# Altium project GSMLiftSquare.PrjPcb
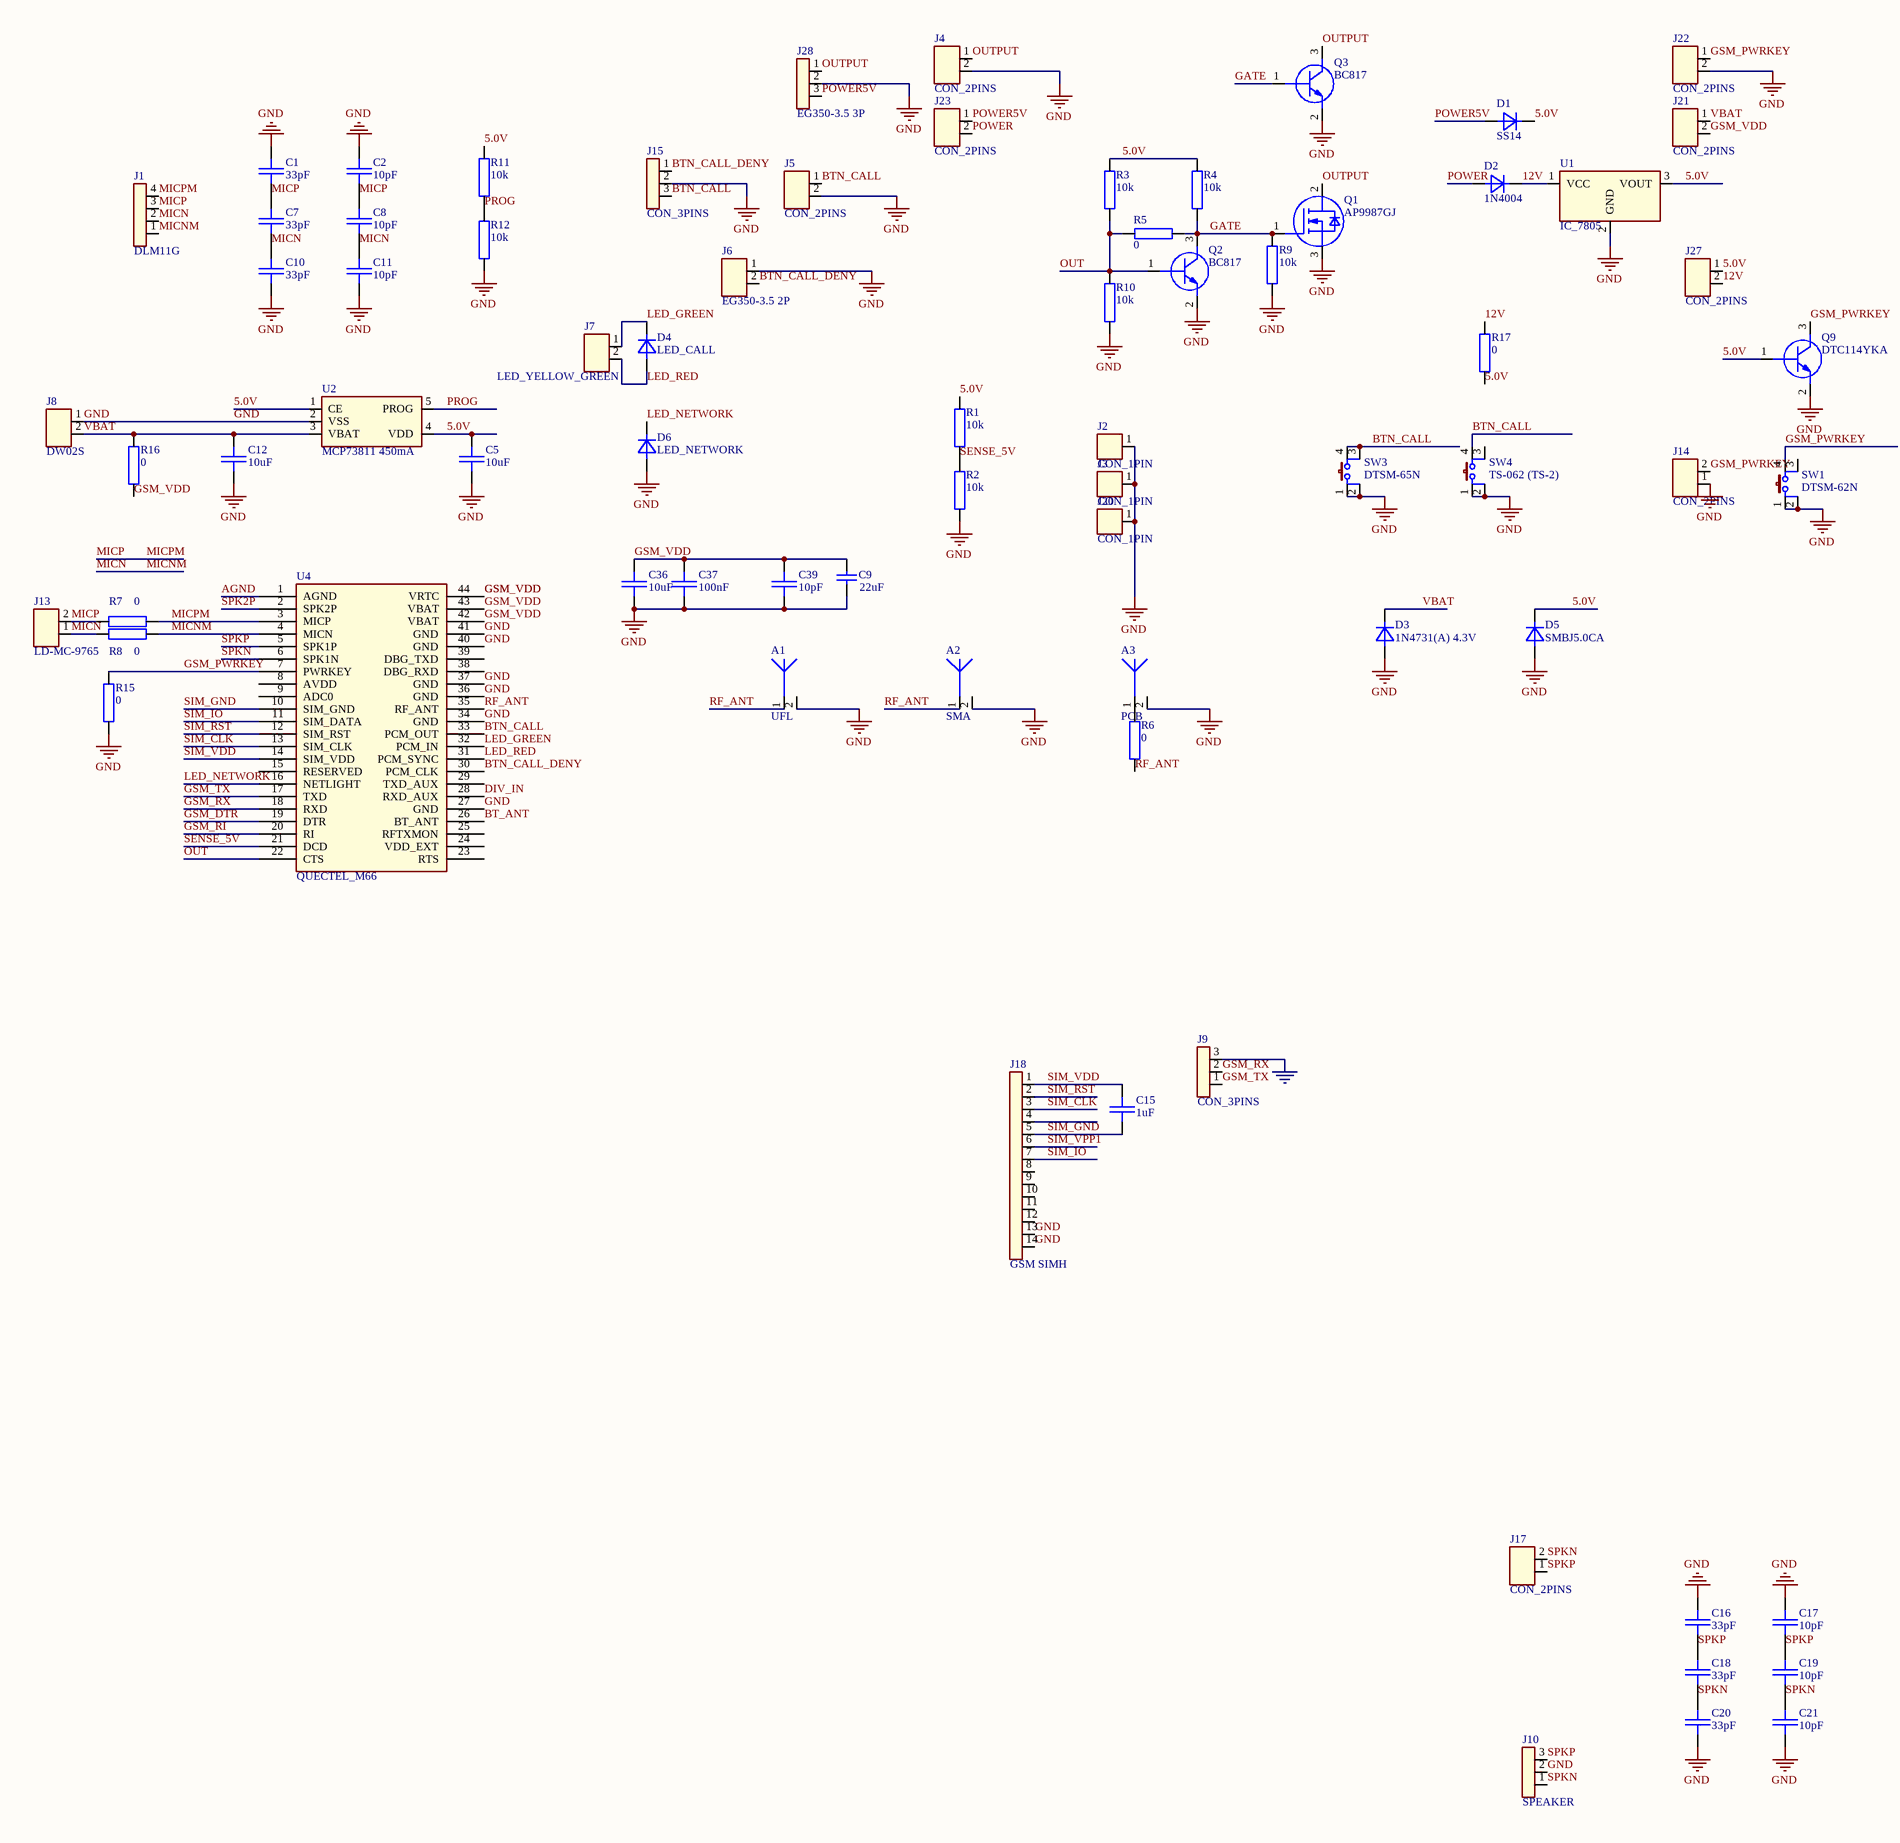
[diagram p0: GSMLiftSquare.SchDoc, left]
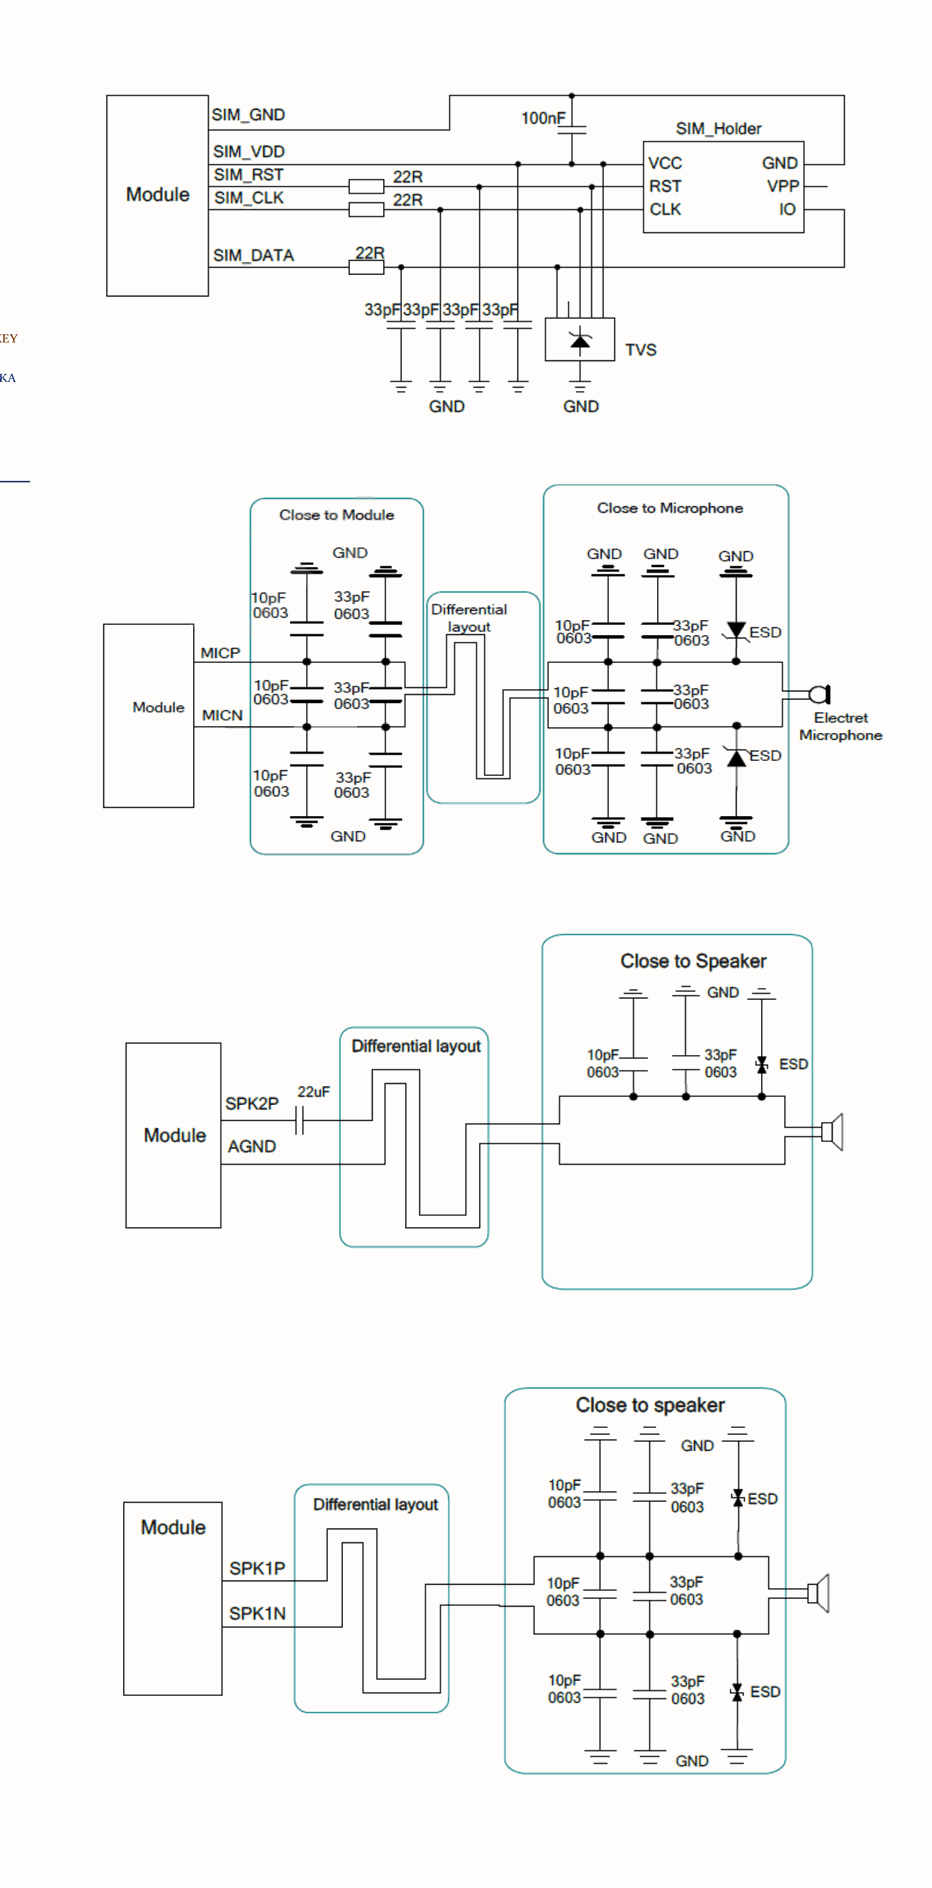
[diagram p1: GSMLiftSquare.SchDoc, right]
1 sheet, 74 parts. Net scope: global (net labels, ports and power ports of the same name join across sheets).
Board file: GSMLiftSquare.PcbDoc

## Sheet GSMLiftSquare.SchDoc
size A2

### Parts
A1  UFL  [SMD_CON_ANTENNA_UFL]
A2  SMA  [SMD_CON_ANTENNA_SMA_RIGHT_ANGLE]
A3  PCB  [SMD_CON_ANTENNA_GSM_PCB_1]
C1  33pF  [SMD_0603_CAPC1608X95N]
C2  10pF  [SMD_0603_CAPC1608X95N]
C5  10uF  [SMD_0603_CAPC1608X95N]
C7  33pF  [SMD_0603_CAPC1608X95N]
C8  10pF  [SMD_0603_CAPC1608X95N]
C9  22uF  [SMD_1210_CAPC3225X279N]
C10  33pF  [SMD_0603_CAPC1608X95N]
C11  10pF  [SMD_0603_CAPC1608X95N]
C12  10uF  [SMD_0603_CAPC1608X95N]
C15  1uF  [SMD_0603_CAPC1608X95N]
C16  33pF  [SMD_0603_CAPC1608X95N]
C17  10pF  [SMD_0603_CAPC1608X95N]
C18  33pF  [SMD_0603_CAPC1608X95N]
C19  10pF  [SMD_0603_CAPC1608X95N]
C20  33pF  [SMD_0603_CAPC1608X95N]
C21  10pF  [SMD_0603_CAPC1608X95N]
C36  10uF  [SMD_0805_CAPC2012X95N]
C37  100nF  [SMD_0603_CAPC1608X95N]
C39  10pF  [SMD_0603_CAPC1608X95N]
D1  SS14  [SMD_DO214AC_SMA]
D2  1N4004  [SMD_DO214AC_SMA]
D3  1N4731(A) 4.3V  [PTH_HDRV02W64P254_1X02]
D4  LED_CALL  [SMD_0805_LED2012X100N]
D5  SMBJ5.0CA  [SMD_DO214AC_SMB]
D6  LED_NETWORK  [SMD_0805_LED2012X100N]
J1  DLM11G  [SMD_COMMON_MODE_CHOKE]
J2  CON_1PIN  [PTH_MOUNT_HOLE]
J3  CON_1PIN  [PTH_MOUNT_HOLE]
J4  CON_2PINS  [PTH_HDRV02W11060P350_1X02]
J5  CON_2PINS  [PTH_HDRV02W11060P500_1X02]
J6  EG350-3.5 2P  [PTH_HDRV02W11060P350_1X02]
J7  LED_YELLOW_GREEN  [PTH_LED-KINGBRIGHT-L-934SGC]
J8  DW02S  [PTH_HDRV02W64P254_1X02_BATTERY]
J9  CON_3PINS  [PTH_HDRV03W64P254_1X03]
J10  SPEAKER  [PTH_SPEAKER_MCABS-227-RC]
J13  LD-MC-9765  [PTH_MIC_9.6MM_6MM]
J14  CON_2PINS  [PTH_HDRV02W64P254_1X02]
J15  CON_3PINS  [PTH_HDRV03W64P254_1X03]
J17  CON_2PINS  [PTH_HDRV02W64P254_1X02]
J18  GSM SIMH  [SMD_CON-ATTEND_SIM_115B-AAA0-R01]
J20  CON_1PIN  [PTH_MOUNT_HOLE]
J21  CON_2PINS  [PTH_HDRV02W64P254_1X02]
J22  CON_2PINS  [PTH_HDRV02W64P254_1X02]
J23  CON_2PINS  [PTH_HDRV02W11060P350_1X02]
J27  CON_2PINS  [PTH_HDRV02W64P254_1X02]
J28  EG350-3.5 3P  [PTH_HDRV02W11060P350_1X03]
Q1  AP9987GJ  [PTH_TO220AB]
Q2  BC817  [SMD_SOT23_SOT95P240X120-3N]
Q3  BC817  [SMD_SOT23_SOT95P240X120-3N]
Q9  DTC114YKA  [SMD_SOT23_SOT95P240X120-3N]
R1  10k  [SMD_0603_RESC1608X55N]
R2  10k  [SMD_0603_RESC1608X55N]
R3  10k  [SMD_0603_RESC1608X55N]
R4  10k  [SMD_0603_RESC1608X55N]
R5  0  [SMD_0603_RESC1608X55N]
R6  0  [SMD_0402_RESC1005X37N]
R7  0  [SMD_0402_RESC1005X37N]
R8  0  [SMD_0402_RESC1005X37N]
R9  10k  [SMD_0603_RESC1608X55N]
R10  10k  [SMD_0603_RESC1608X55N]
R11  10k  [SMD_0603_RESC1608X55N]
R12  10k  [SMD_0603_RESC1608X55N]
R15  0  [SMD_0603_RESC1608X55N]
R16  0  [SMD_0603_RESC1608X55N]
R17  0  [SMD_0603_RESC1608X55N]
SW1  DTSM-62N  [SMD_SW_TACT-64K_5]
SW3  DTSM-65N  [SMD_SW_TACT-64K_5]
SW4  TS-062 (TS-2)  [PTH_SWI_TACT-62K_5]
U1  IC_7805  [PTH_TO220AB]
U2  MCP73811 450mA  [SMD_SOT26_SOT95P285X140-5N - DLV]
U4  QUECTEL_M66  [SMD_MOD_M66-44N]

### Nets
GND: A1.2 A2.2 A3.2 C1.1 C2.1 C5.2 C9.2 C10.2 C11.2 C12.2 C16.1 C17.1 C20.2 C21.2 C36.2 C37.2 C39.2 D3.2(A) D5.2(A) D6.2(A) J2.1 J3.1 J4.2 J5.2 J6.1 J8.1 J9.3 J10.2 J14.1 J15.2 J18.13 J18.14 J20.1 J22.2 J28.2 Q1.3(S) Q2.2(E) Q3.2(E) Q9.2(E) R2.2 R9.2 R10.2 R12.2 R15.2 SW1.1 SW1.2 SW3.1 SW3.2 SW4.1 SW4.2 U1.2(GND) U2.2(VSS) U4.27(GND) U4.34(GND) U4.36(GND) U4.37(GND) U4.40(GND) U4.41(GND)
5.0V: C5.1 D1.1(C) D5.1(C) J27.1 Q9.1(B) R1.1 R3.1 R4.1 R11.1 R17.2 U1.3(VOUT) U2.1(CE) U2.4(VDD)
12V: D2.1(C) J27.2 R17.1 U1.1(VCC)
AGND: U4.1(AGND)
BT_ANT: U4.26(BT_ANT)
BTN_CALL: J5.1 J15.3 SW3.3 SW3.4 SW4.4 U4.33(PCM_OUT)
BTN_CALL_DENY: J6.2 J15.1 U4.30(PCM_CLK)
DIV_IN: U4.28(RXD_AUX)
GATE: Q1.1(G) Q2.3(C) Q3.1(B) R4.2 R5.2 R9.1
GSM_DTR: U4.19(DTR)
GSM_PWRKEY: J14.2 J22.1 Q9.3(C) R15.1 SW1.4 U4.7(PWRKEY)
GSM_RI: U4.20(RI)
GSM_RX: J9.2 U4.18(RXD)
GSM_TX: J9.1 U4.17(TXD)
GSM_VDD: C9.1 C36.1 C37.1 C39.1 J21.2 R16.1 U4.42(VBAT) U4.43(VBAT) U4.44(VRTC)
LED_GREEN: D4.1(C) J7.1 U4.32(PCM_IN)
LED_NETWORK: D6.1(C) U4.16(NETLIGHT)
LED_RED: D4.2(A) J7.2 U4.31(PCM_SYNC)
MICN: C7.2 C8.2 C10.1 C11.1 J1.1 J1.2 J13.1 R8.1 R8.2 U4.4(MICN)  [also labelled MICNM]
MICP: C1.2 C2.2 C7.1 C8.1 J1.3 J1.4 J13.2 R7.1 R7.2 U4.3(MICP)  [also labelled MICPM]
OUT: Q2.1(B) R3.2 R5.1 R10.1 U4.22(CTS)
OUTPUT: J4.1 J28.1 Q1.2(D) Q3.3(C)
POWER: D2.2(A) J23.2
POWER5V: D1.2(A) J23.1 J28.3
PROG: R11.2 R12.1 U2.5(PROG)
RF_ANT: A1.1 A2.1 R6.2 U4.35(RF_ANT)
SENSE_5V: R1.2 R2.1 U4.21(DCD)
SIM_CLK: J18.3 U4.13(SIM_CLK)
SIM_GND: C15.2 J18.5 U4.10(SIM_GND)
SIM_IO: J18.7 U4.11(SIM_DATA)
SIM_RST: J18.2 U4.12(SIM_RST)
SIM_VDD: C15.1 J18.1 U4.14(SIM_VDD)
SIM_VPP1: J18.6
SPK2P: U4.2(SPK2P)
SPKN: C18.2 C19.2 C20.1 C21.1 J10.1 J17.2 U4.6(SPK1N)
SPKP: C16.2 C17.2 C18.1 C19.1 J10.3 J17.1 U4.5(SPK1P)
VBAT: C12.1 D3.1(C) J8.2 J21.1 R16.2 U2.3(VBAT)
NetA3_1: A3.1 R6.1

Not connected (* = marked no-connect by the designer): J18 4 8 9 10 11 12; SW1 3; SW4 3; U4 8(AVDD) 9(ADC0) 15(RESERVED) 23(RTS) 24(VDD_EXT) 25(RFTXMON) 29(TXD_AUX) 38(DBG_RXD) 39(DBG_TXD)

### Library data of the parts
A1-A3 = ANTENNA_2: NOTE: <NOTE>
C1 C2 C5 C7 C8 C10-C12 C15-C21 C36 C37 C39 = C: NOTE: <NOTE>
C9 = Cap Semi: CL32A227MQVNNNE 220UF 6.3V 20% X5R 1210; Published: 8-Jun-2000; LatestRevisionDate: 29-May-2009; LatestRevisionNote: IPC-7351 Footprint Added.; PackageReference: C1206; Publisher: Altium Limited; PackageDescription: Chip Capacitor; Value: 22uF
D1-D6 = D: NOTE: <NOTE>
J1 = CON_4PINS
J2 J3 J20 = CON_1PIN: NOTE: <NOTE>
J4-J8 J13 J14 J17 J21-J23 J27 = CON_2PINS: NOTE: <NOTE>
J10 J28 = CON_3PINS
J18 = CON_14PINS
Q1 = MOS_N_D1_G1D2S3: NOTE: <NOTE>
Q2 Q3 Q9 = BJT_NPN_B1E2C3: NOTE: <NOTE>
R1-R12 R15-R17 = R: NOTE: <NOTE>; R_BDS: R
SW1 SW3 SW4 = BUTTON_1
U1 = IC_7805: NOTE: <NOTE>
U2 = IC_MCP73812: MCP73812; DB_PART_NUMBER: PSU000000127; DB_PART_TYPE: Linear Voltage Regulator; DB_MANUFACTURER_PART: ROHM        BD33KA5WF-E2; DB_T_RANGE: -40 to 105; DB_VOLTAGE: 3.3V; DB_CURRENT: 500mA; DB_PACKAGE: SOIC-8; DB_DESCRIPTION: IC BD33KA5WF-E2 SOIC-8; DB_PCB_DEVICE: SMD_SOIC127P620X160-8N; DB_CERTIFIED: ISHIDDEN=T; DB_APPROVED_BY: VSN; DB_APPROVED_ON: 07.5.2014 г. 13:18:28; DB_STATUS: NEW; DB_DATASHEET: http://john.epiqdesign.com/projects/CIS_Datasheets/IC_bdxxka5wf-e-209388.pdf?rev=1408&sc=0
U4 = MOD_QUECTEL_M66

## Assembly variants
Production: not fitted A3 C9 C15 J2 J3 J20 Q2 Q3 R2 R3 R4 R6 R7 R8 R10 R12 R13 SW4
Production_Last: not fitted A1 A3 C9 C15 C39 D2 D4 D6 J1 J2 J3 J4 J5 J11 J12 J14 J15 J16 J17 J19 J20 J21 J22 J23 J24 J25 J26 J27 Q2 Q3 R2 R3 R4 R7 R8 R10 R11 R12 R13 R14 R17 SW1 SW4 U1
Production_24V: not fitted A1 A3 C9 C15 C36 C37 C39 D4 D6 J1 J2 J3 J4 J5 J9 J11 J12 J14 J15 J16 J17 J19 J20 J21 J22 J23 J24 J25 J26 J27 Q2 Q3 R2 R3 R4 R6 R7 R8 R10 R11 R12 R13 R14 R17 SW1 SW4